# Altium schematic sheet ELECTRO3.SchDoc
size A
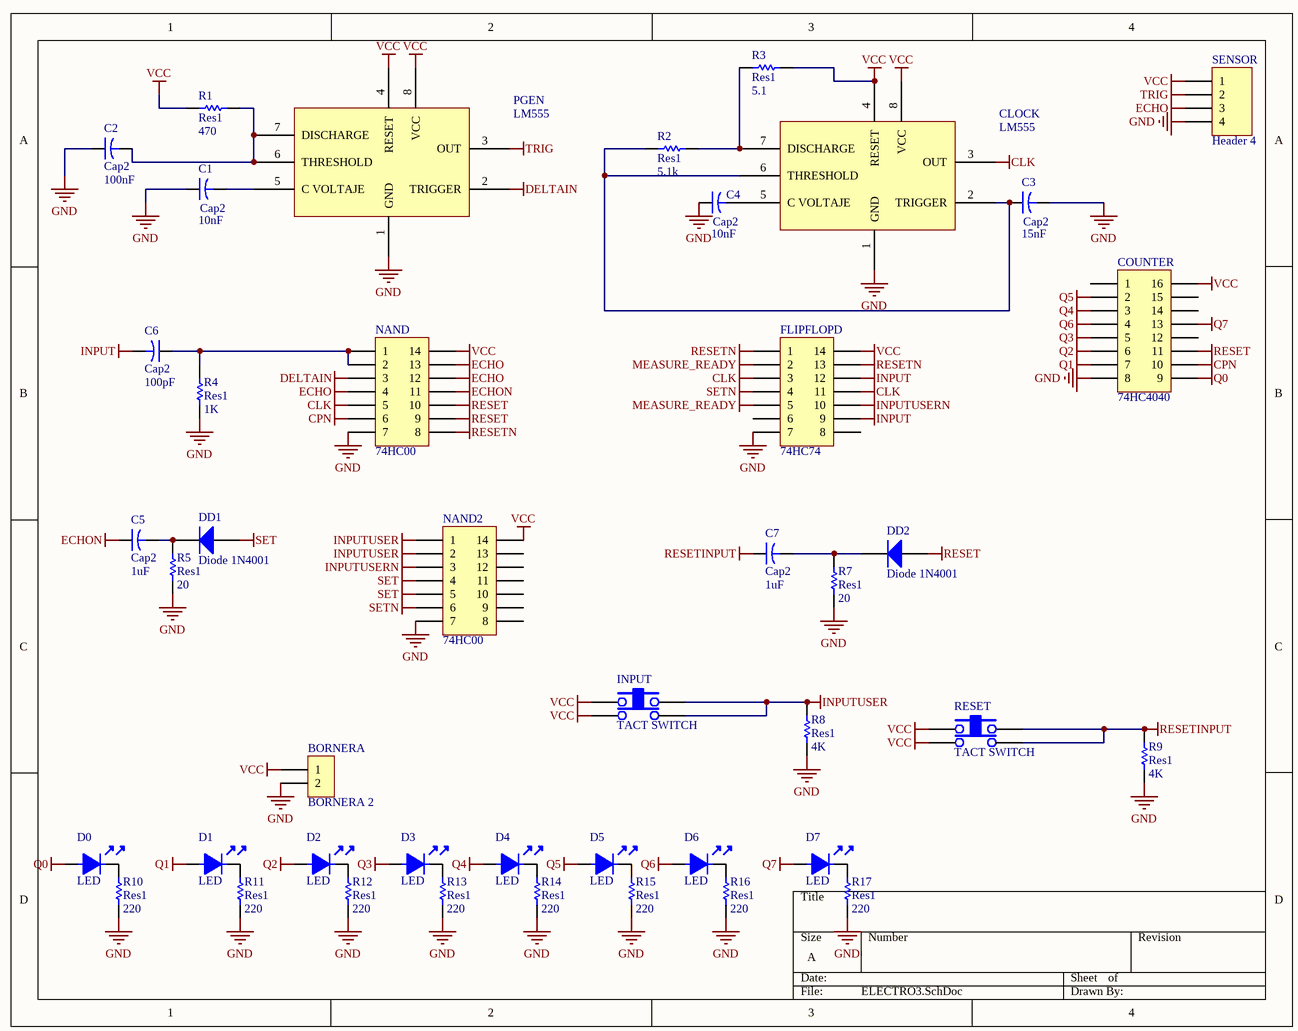
[diagram p0: ELECTRO3.SchDoc]

## Parts
BORNERA  BORNERA 2  [BORNERA2]
C1  Cap2  value 10nF  [CAPR5-4X5]
C2  Cap2  value 100nF  [CAPR5-4X5]
C3  Cap2  value 15nF  [CAPR5-4X5]
C4  Cap2  value 10nF  [CAPR5-4X5]
C5  Cap2  value 1uF  [CAPR5-4X5]
C6  Cap2  value 100pF  [CAPR5-4X5]
C7  Cap2  value 1uF  [CAPR5-4X5]
CLOCK  LM555  [DIP8]
COUNTER  74HC4040  [DIP16]
D0  LED  [LED3]
D1  LED  [LED3]
D2  LED  [LED3]
D3  LED  [LED3]
D4  LED  [LED3]
D5  LED  [LED3]
D6  LED  [LED3]
D7  LED  [LED3]
DD1  Diode 1N4001  [DO-41]
DD2  Diode 1N4001  [DO-41]
FLIPFLOPD  74HC74  [DIP14]
INPUT  TACT SWITCH  [TACTSWITCH]
NAND  74HC00  [DIP14]
NAND2  74HC00  [DIP14]
PGEN  LM555  [DIP8]
R1  Res1  value 470  [AXIAL-0.3]
R2  Res1  value 5.1k  [AXIAL-0.3]
R3  Res1  value 5.1  [AXIAL-0.3]
R4  Res1  value 1K  [AXIAL-0.3]
R5  Res1  value 20  [AXIAL-0.3]
R7  Res1  value 20  [AXIAL-0.3]
R8  Res1  value 4K  [AXIAL-0.3]
R9  Res1  value 4K  [AXIAL-0.3]
R10  Res1  value 220  [AXIAL-0.3]
R11  Res1  value 220  [AXIAL-0.3]
R12  Res1  value 220  [AXIAL-0.3]
R13  Res1  value 220  [AXIAL-0.3]
R14  Res1  value 220  [AXIAL-0.3]
R15  Res1  value 220  [AXIAL-0.3]
R16  Res1  value 220  [AXIAL-0.3]
R17  Res1  value 220  [AXIAL-0.3]
RESET  TACT SWITCH  [TACTSWITCH]
SENSOR  Header 4  [HDR1X4]

## Nets
CLK: CLOCK.3(OUT) FLIPFLOPD.3 FLIPFLOPD.11 NAND.5
CPN: COUNTER.10 NAND.6
DELTAIN: NAND.3 PGEN.2(TRIGGER)
ECHO: NAND.4 NAND.12 NAND.13 SENSOR.3
ECHON: C5.1 NAND.11
GND: BORNERA.2 C1.1 C2.1 C3.2 C4.1 CLOCK.1(GND) COUNTER.8 FLIPFLOPD.7 NAND.7 NAND2.7 PGEN.1(GND) R4.2 R5.1 R7.1 R8.1 R9.1 R10.1 R11.1 R12.1 R13.1 R14.1 R15.1 R16.1 R17.1 SENSOR.4
INPUT: C6.2 FLIPFLOPD.9 FLIPFLOPD.12
INPUTUSER: INPUT.3 INPUT.4 NAND2.1 NAND2.2 R8.2
INPUTUSERN: FLIPFLOPD.10 NAND2.3
MEASURE_READY: FLIPFLOPD.2 FLIPFLOPD.5
Q0: COUNTER.9 D0.1
Q1: COUNTER.7 D1.1
Q2: COUNTER.6 D2.1
Q3: COUNTER.5 D3.1
Q4: COUNTER.3 D4.1
Q5: COUNTER.2 D5.1
Q6: COUNTER.4 D6.1
Q7: COUNTER.13 D7.1
RESET: COUNTER.11 DD2.1(A) NAND.9 NAND.10
RESETINPUT: C7.1 R9.2 RESET.3 RESET.4
RESETN: FLIPFLOPD.1 FLIPFLOPD.13 NAND.8
SET: DD1.1(A) NAND2.4 NAND2.5
SETN: FLIPFLOPD.4 NAND2.6
TRIG: PGEN.3(OUT) SENSOR.2
VCC: BORNERA.1 CLOCK.4(RESET) CLOCK.8(VCC) COUNTER.16 FLIPFLOPD.14 INPUT.1 INPUT.2 NAND.14 NAND2.14 PGEN.4(RESET) PGEN.8(VCC) R1.1 R3.2 RESET.1 RESET.2 SENSOR.1
NetC1_2: C1.2 PGEN.5(C_VOLTAJE)
NetC2_2: C2.2 PGEN.6(THRESHOLD) PGEN.7(DISCHARGE) R1.2
NetC3_1: C3.1 CLOCK.2(TRIGGER) CLOCK.6(THRESHOLD) R2.1
NetC4_2: C4.2 CLOCK.5(C_VOLTAJE)
NetC5_2: C5.2 DD1.2(K) R5.2
NetC6_1: C6.1 NAND.1 NAND.2 R4.1
NetC7_2: C7.2 DD2.2(K) R7.2
NetCLOCK_7: CLOCK.7(DISCHARGE) R2.2 R3.1
NetD0_2: D0.2 R10.2
NetD1_2: D1.2 R11.2
NetD2_2: D2.2 R12.2
NetD3_2: D3.2 R13.2
NetD4_2: D4.2 R14.2
NetD5_2: D5.2 R15.2
NetD6_2: D6.2 R16.2
NetD7_2: D7.2 R17.2

Not connected (* = marked no-connect by the designer): COUNTER 1 12 14 15; FLIPFLOPD 6 8; NAND2 8 9 10 11 12 13

## Library data of the parts
C1-C7 = Cap2: Capacitor; Published: 23-Sep-2002; PackageReference: CAPR5-4X5; Publisher: Altium Limited; PackageDescription: Capacitor; 2 Leads
CLOCK PGEN = LM555: Timer
COUNTER = IC_DIP16
DD1 DD2 = Diode 1N4001: 1 Amp General Purpose Rectifier; Published: 8-Jun-2000; LatestRevisionDate: 17-Jul-2002; LatestRevisionNote: Re-released for DXP Platform.; DatasheetVersion: 1998; PackageVersion: Aug-1999; PackageReference: DO-41; Publisher: Altium Limited; PackageDescription: Diode, Axial; Body 5.2 x 2.7 mm (LxDia. max), Lead Dia. 0.86 mm (max); Code_JEDEC: DO-204-AL; ComponentLink1Description: Manufacturer Link; ComponentLink1URL: http://www.fairchildsemi.com/; ComponentLink2Description: Datasheet; ComponentLink2URL: http://www.fairchildsemi.com/ds/1N%2F1N4001.pdf
FLIPFLOPD NAND NAND2 = IC_DIP14
R1-R5 R7-R17 = Res1: Resistor; Published: 8-Jun-2000; LatestRevisionDate: 17-Jul-2002; LatestRevisionNote: Re-released for DXP Platform.; PackageReference: AXIAL-0.3; Publisher: Altium Limited; PackageDescription: Axial Device, Thru-Hole; 2 Leads; 0.3 in Pin Spacing
SENSOR = Header 4: Header, 4-Pin; LatestRevisionDate: 17-Jul-2002; LatestRevisionNote: Re-released for DXP Platform.; Publisher: Altium Limited